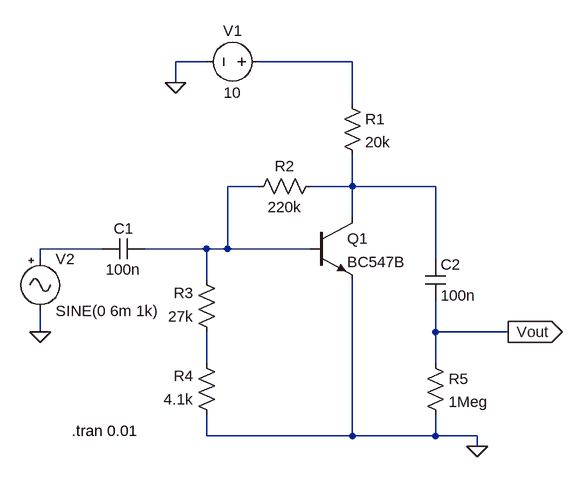
[diagram p0: schematic Draft12.asc]
Draft12.asc, the LTspice schematic file:
Version 4
SHEET 1 888 680
WIRE 96 32 48 32
WIRE 320 32 176 32
WIRE 48 64 48 32
WIRE 320 96 320 32
WIRE 176 224 128 224
WIRE 320 224 320 176
WIRE 320 224 256 224
WIRE 448 224 320 224
WIRE 320 272 320 224
WIRE -64 320 -160 320
WIRE 96 320 0 320
WIRE 128 320 128 224
WIRE 128 320 96 320
WIRE 256 320 128 320
WIRE -160 336 -160 320
WIRE 448 336 448 224
WIRE 96 368 96 320
WIRE -160 448 -160 416
WIRE 448 448 448 400
WIRE 560 448 448 448
WIRE 96 496 96 448
WIRE 448 496 448 448
WIRE 96 608 96 576
WIRE 320 608 320 368
WIRE 320 608 96 608
WIRE 448 608 448 576
WIRE 448 608 320 608
WIRE 512 608 448 608
WIRE 512 624 512 608
FLAG 48 64 0
FLAG 512 624 0
FLAG 560 448 Vout
IOPIN 560 448 Out
FLAG -160 448 0
SYMBOL voltage 192 32 R90
WINDOW 0 -32 56 VBottom 2
WINDOW 3 32 56 VTop 2
SYMATTR InstName V1
SYMATTR Value 10
SYMBOL res 304 80 R0
SYMATTR InstName R1
SYMATTR Value 20k
SYMBOL res 272 208 R90
WINDOW 0 0 56 VBottom 2
WINDOW 3 32 56 VTop 2
SYMATTR InstName R2
SYMATTR Value 220k
SYMBOL res 112 464 R180
WINDOW 0 36 76 Left 2
WINDOW 3 36 40 Left 2
SYMATTR InstName R3
SYMATTR Value 27k
SYMBOL res 112 592 R180
WINDOW 0 36 76 Left 2
WINDOW 3 36 40 Left 2
SYMATTR InstName R4
SYMATTR Value 4.1k
SYMBOL npn 256 272 R0
SYMATTR InstName Q1
SYMATTR Value BC547B
SYMBOL cap 0 304 R90
WINDOW 0 0 32 VBottom 2
WINDOW 3 32 32 VTop 2
SYMATTR InstName C1
SYMATTR Value 100n
SYMBOL cap 432 336 R0
SYMATTR InstName C2
SYMATTR Value 100n
SYMBOL res 432 480 R0
SYMATTR InstName R5
SYMATTR Value 1Meg
SYMBOL Misc/signal -160 320 R0
SYMATTR InstName V2
SYMATTR Value SINE(0 6m 1k)
TEXT -112 600 Left 2 !.tran 0.01

The netlist it stands for:
* Draft12.asc
V1 N001 0 10
R1 N001 N003 20k
R2 N003 N002 220k
R3 N005 N002 27k
R4 0 N005 4.1k
Q1 N003 N002 0 0 BC547B
C1 N002 N004 100n
C2 N003 Vout 100n
R5 Vout 0 1Meg
V2 N004 0 SINE(0 6m 1k)
.model NPN NPN
.model PNP PNP
.lib standard.bjt
.tran 0.01
.backanno
.end